# EAGLE design lna-plug (EAGLE 7.1.0)

## Sheet 1 of 3
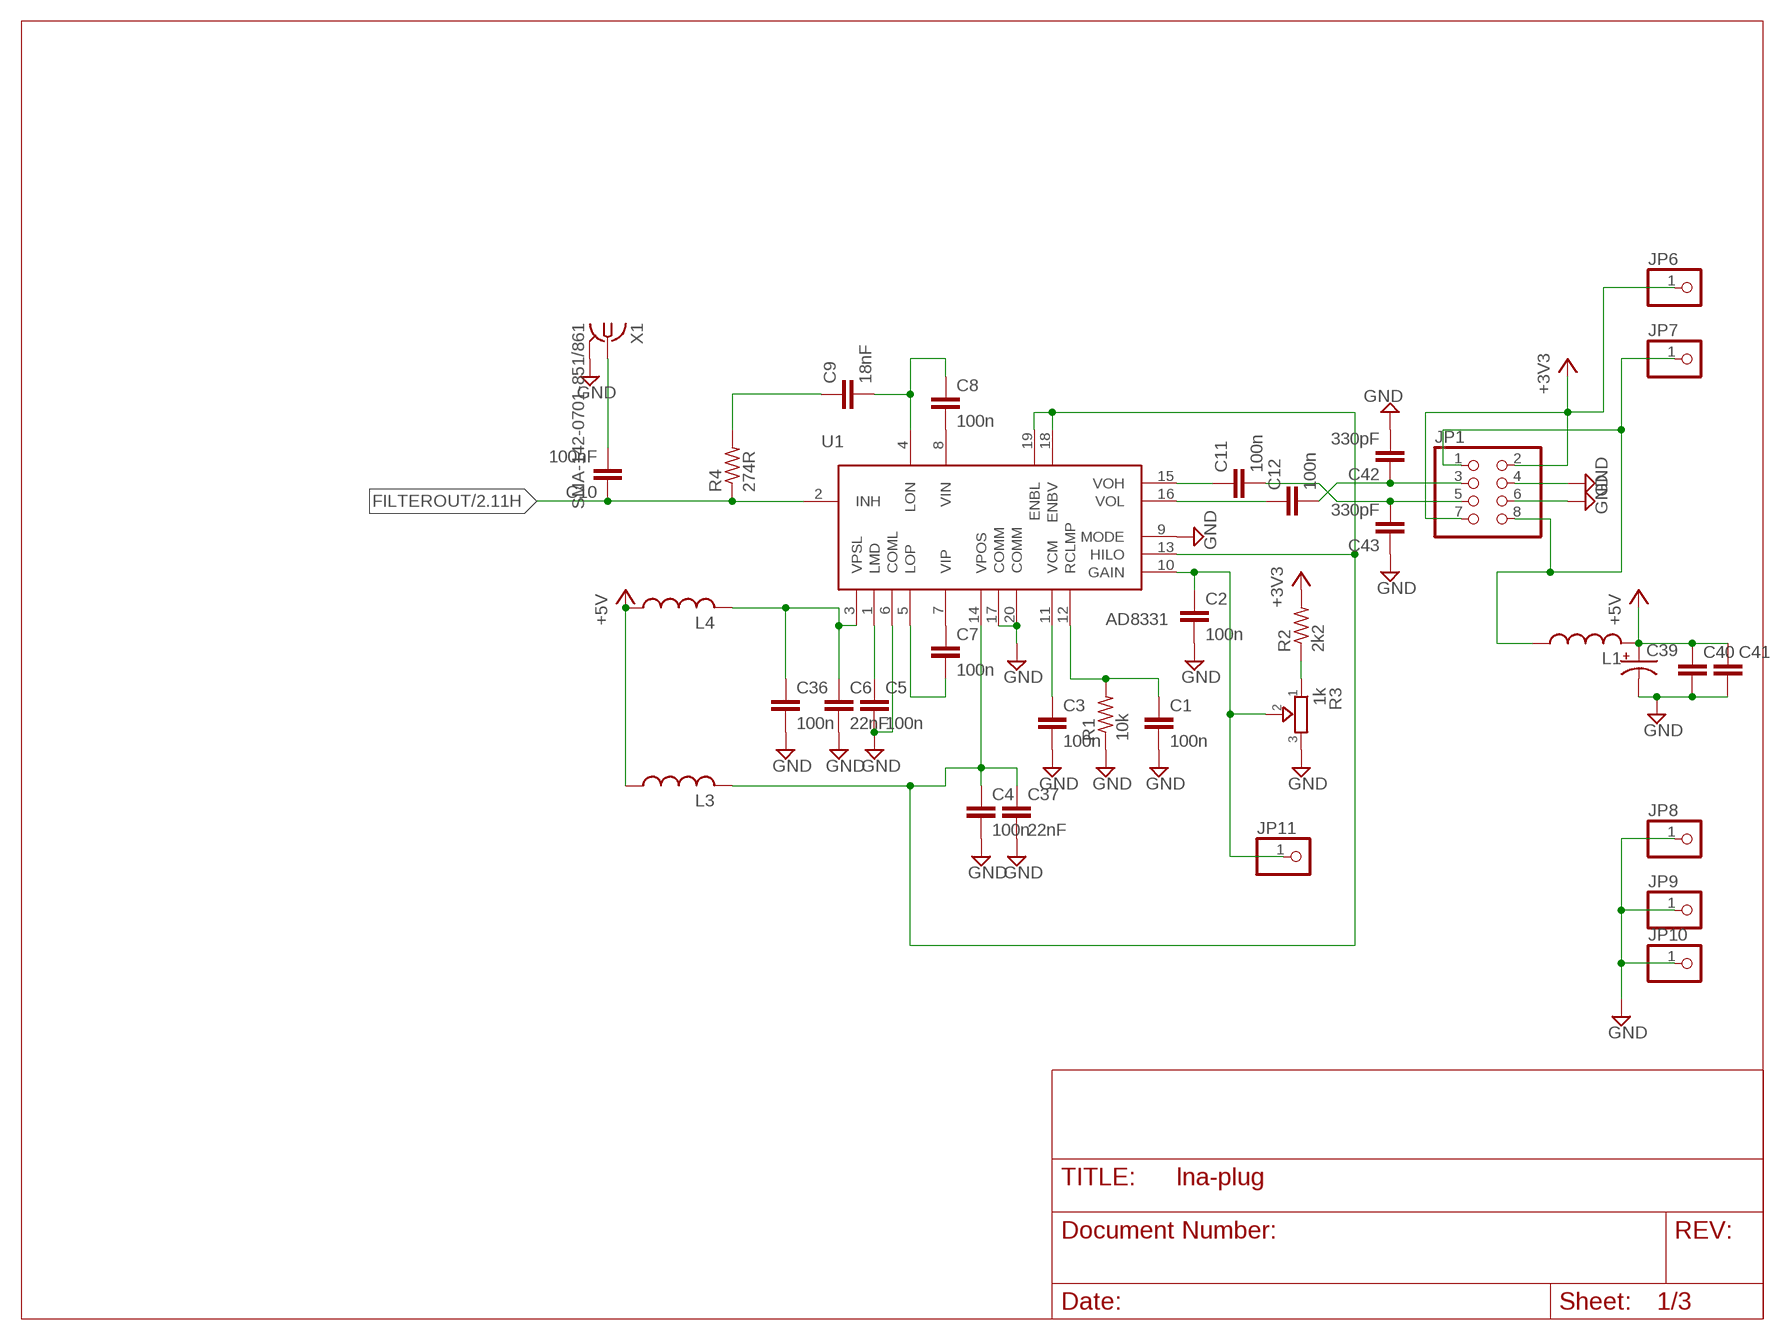
[diagram p0: schematic, sheet 1]

### Parts
C1  100n  C-EUC0603  [C0603]
C2  100n  C-EUC0603  [C0603]
C3  100n  C-EUC0603  [C0603]
C4  100n  C-EUC0603  [C0603]
C5  100n  C-EUC0603  [C0603]
C6  22nF  C-EUC0603  [C0603]
C7  100n  C-EUC0603  [C0603]
C8  100n  C-EUC0603  [C0603]
C9  18nF  C-EUC0603  [C0603]
C10  100nF  C-EUC0603  [C0603]
C11  100n  C-EUC0603  [C0603]
C12  100n  C-EUC0603  [C0603]
C36  100n  C-EUC0603  [C0603]
C37  22nF  C-EUC0603  [C0603]
C39  CPOL-USSMCC  [SMC_C]
C40  C-EUC1206  [C1206]
C41  C-EUC0805  [C0805]
C42  330pF  C-EUC0603  [C0603]
C43  330pF  C-EUC0603  [C0603]
JP1  PINHD-2X4  [2X04]
JP6  PINHD-1X1  [1X01]
JP7  PINHD-1X1  [1X01]
JP8  PINHD-1X1  [1X01]
JP9  PINHD-1X1  [1X01]
JP10  PINHD-1X1  [1X01]
JP11  PINHD-1X1  [1X01]
L1  L-USL2012C  [L2012C]
L3  L-USL2012C  [L2012C]
L4  L-USL2012C  [L2012C]
R1  10k  R-US_R0603  [R0603]
R2  2k2  R-US_R0603  [R0603]
R3  1k  TRIMMER-3362P  [TRIMMER_3362P]
R4  274R  R-US_R0603  [R0603]
U1  AD8331  [QSOP20]
X1  SMA-142-0701-851/861  [J502-ND-142-0701-851/861]

### Nets
+3V3: JP1.2 JP1.7 JP6.1 R2.2 ; also sheet 3
+5V: C39.+ C40.1 C41.1 L1.2 L3.1 L4.1
FILTEROUT: C10.1 R4.1 U1.2(INH) ; also sheet 2
GND: C1.2 C2.2 C3.2 C4.2 C5.2 C6.2 C36.2 C37.2 C39.- C40.2 C41.2 C42.2 C43.1 JP1.4 JP1.6 JP8.1 JP9.1 JP10.1 R1.1 R3.3 U1.6(COML) U1.9(MODE) U1.17(COMM) U1.20(COMM) X1.G@1 X1.G@2 X1.G@3 X1.G@4 ; also sheet 2,3
N$1: C7.1 U1.7(VIP)
N$2: C8.2 U1.8(VIN)
N$3: C8.1 C9.2 U1.4(LON)
N$5: C7.2 U1.5(LOP)
N$7: C3.1 U1.11(VCM)
N$8: C1.1 R1.2 U1.12(RCLMP)
N$10: C2.1 JP11.1 R3.2 U1.10(GAIN)
N$11: R2.1 R3.1
N$15: C5.1 U1.1(LMD)
N$16: C6.1 C36.1 L4.2 U1.3(VPSL)
N$19: C9.1 R4.2
N$21: C12.1 U1.16(VOL)
N$22: C11.1 U1.15(VOH)
N$23: C12.2 C42.1 JP1.3
N$24: C11.2 C43.2 JP1.5
N$25: JP1.1 JP1.8 JP7.1 L1.1
N$35: C10.2 X1.1
N$45: C4.1 C37.1 L3.2 U1.13(HILO) U1.14(VPOS) U1.18(ENBV) U1.19(ENBL)

## Sheet 2 of 3
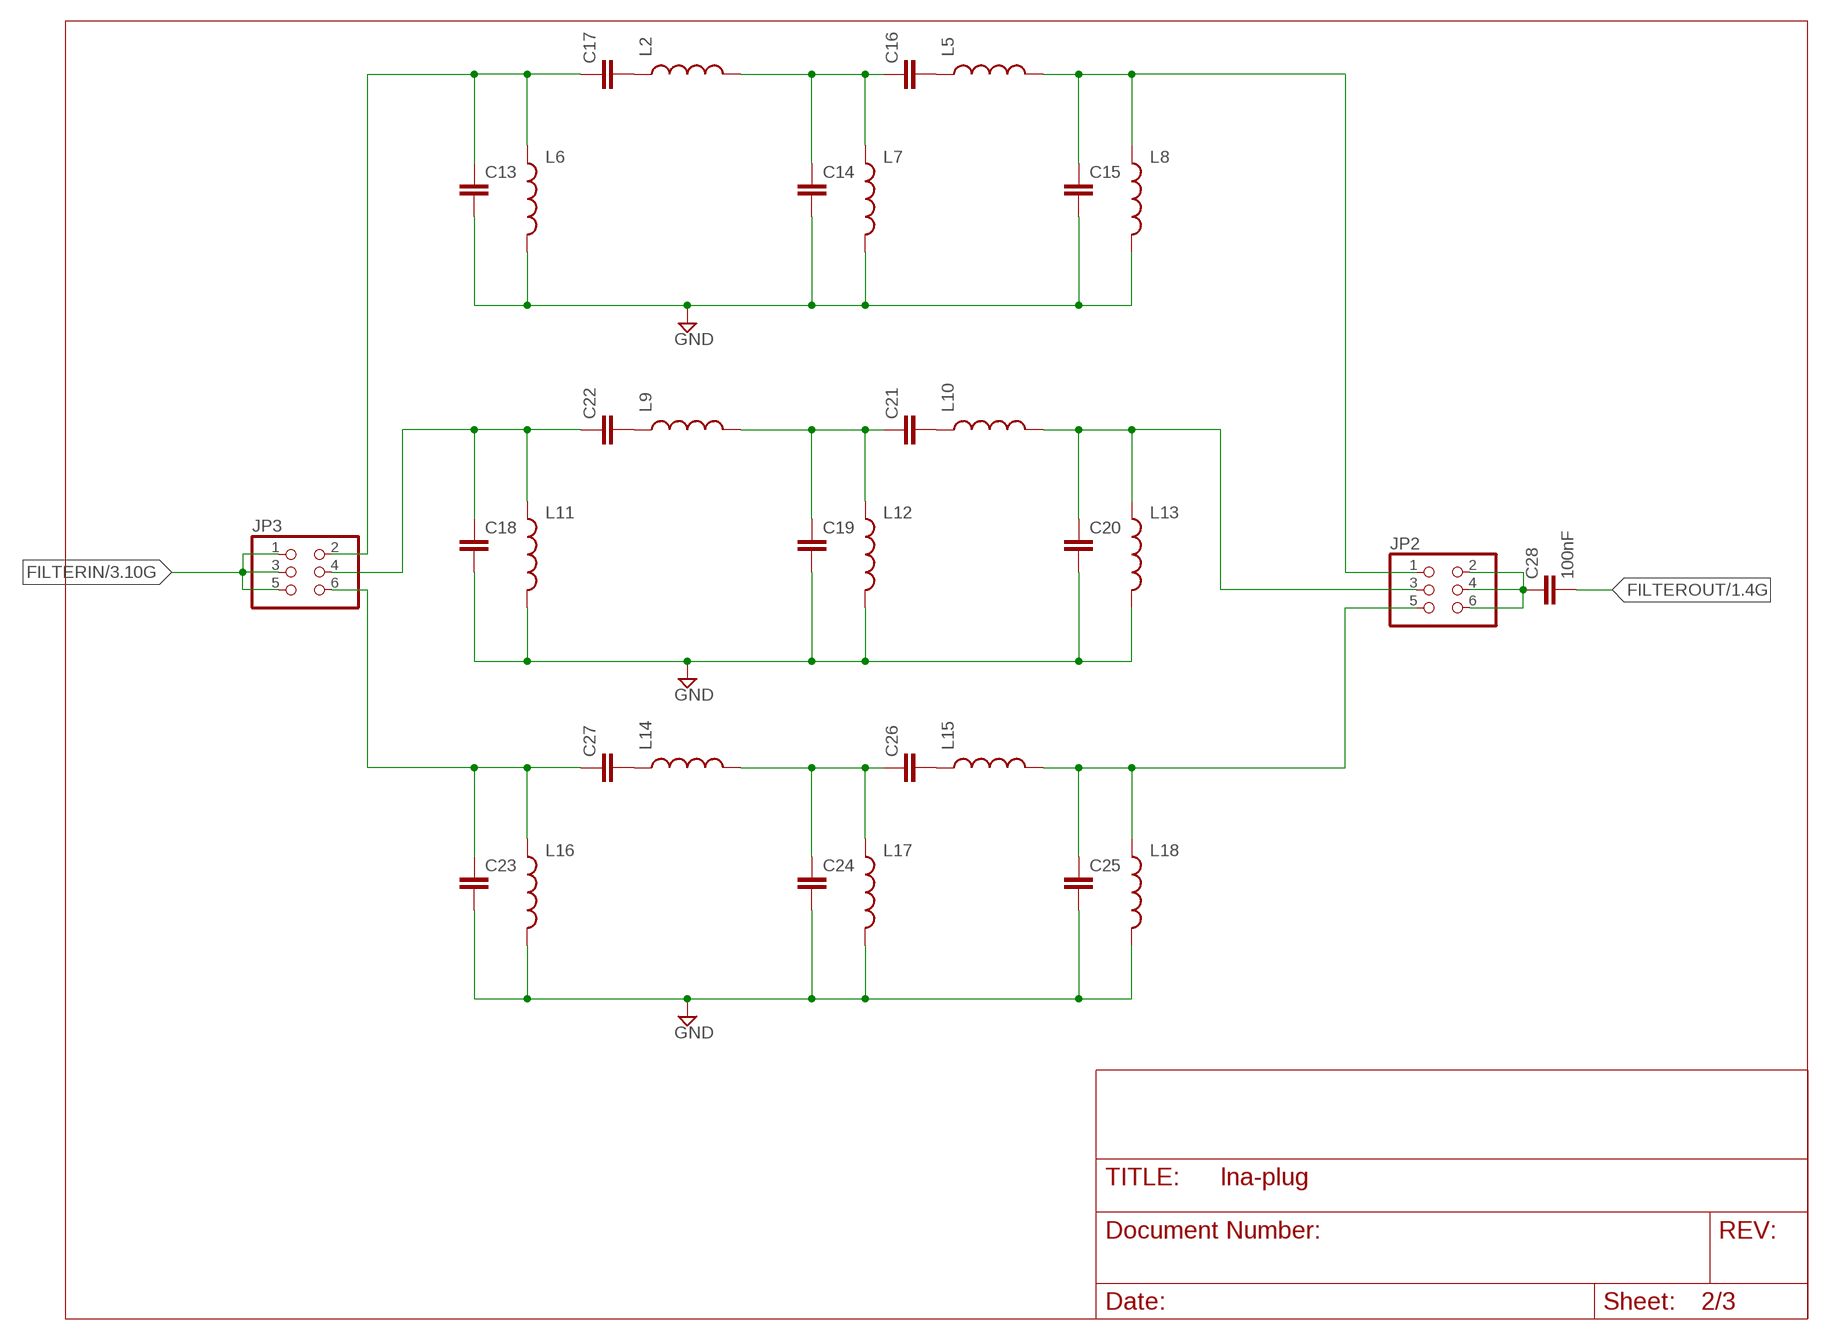
[diagram p1: schematic, sheet 2]

### Parts
C13  C-EUC0603  [C0603]
C14  C-EUC0603  [C0603]
C15  C-EUC0603  [C0603]
C16  C-EUC0603  [C0603]
C17  C-EUC0603  [C0603]
C18  C-EUC0603  [C0603]
C19  C-EUC0603  [C0603]
C20  C-EUC0603  [C0603]
C21  C-EUC0603  [C0603]
C22  C-EUC0603  [C0603]
C23  C-EUC0603  [C0603]
C24  C-EUC0603  [C0603]
C25  C-EUC0603  [C0603]
C26  C-EUC0603  [C0603]
C27  C-EUC0603  [C0603]
C28  100nF  C-EUC0603  [C0603]
JP2  PINHD-2X3  [2X03]
JP3  PINHD-2X3  [2X03]
L2  INDUCTOR0603  [0603]
L5  INDUCTOR0603  [0603]
L6  INDUCTOR0603  [0603]
L7  INDUCTOR0603  [0603]
L8  INDUCTOR0603  [0603]
L9  INDUCTOR0603  [0603]
L10  INDUCTOR0603  [0603]
L11  INDUCTOR0603  [0603]
L12  INDUCTOR0603  [0603]
L13  INDUCTOR0603  [0603]
L14  INDUCTOR0603  [0603]
L15  INDUCTOR0603  [0603]
L16  INDUCTOR0603  [0603]
L17  INDUCTOR0603  [0603]
L18  INDUCTOR0603  [0603]

### Nets
FILTERIN: JP3.1 JP3.3 JP3.5 ; also sheet 3
FILTEROUT: C28.2 ; also sheet 1
GND: C13.2 C14.2 C15.2 C18.2 C19.2 C20.2 C23.2 C24.2 C25.2 L6.2 L7.2 L8.2 L11.2 L12.2 L13.2 L16.2 L17.2 L18.2 ; also sheet 1,3
N$9: C17.2 L2.1
N$12: C16.2 L5.1
N$13: C14.1 C16.1 L2.2 L7.1
N$14: C15.1 JP2.1 L5.2 L8.1
N$17: C23.1 C27.1 JP3.6 L16.1
N$20: C22.2 L9.1
N$26: C21.2 L10.1
N$27: C19.1 C21.1 L9.2 L12.1
N$28: C25.1 JP2.5 L15.2 L18.1
N$29: C18.1 C22.1 JP3.4 L11.1
N$30: C27.2 L14.1
N$31: C26.2 L15.1
N$32: C24.1 C26.1 L14.2 L17.1
N$33: C28.1 JP2.2 JP2.4 JP2.6
N$34: C13.1 C17.1 JP3.2 L6.1
N$37: C20.1 JP2.3 L10.2 L13.1

## Sheet 3 of 3
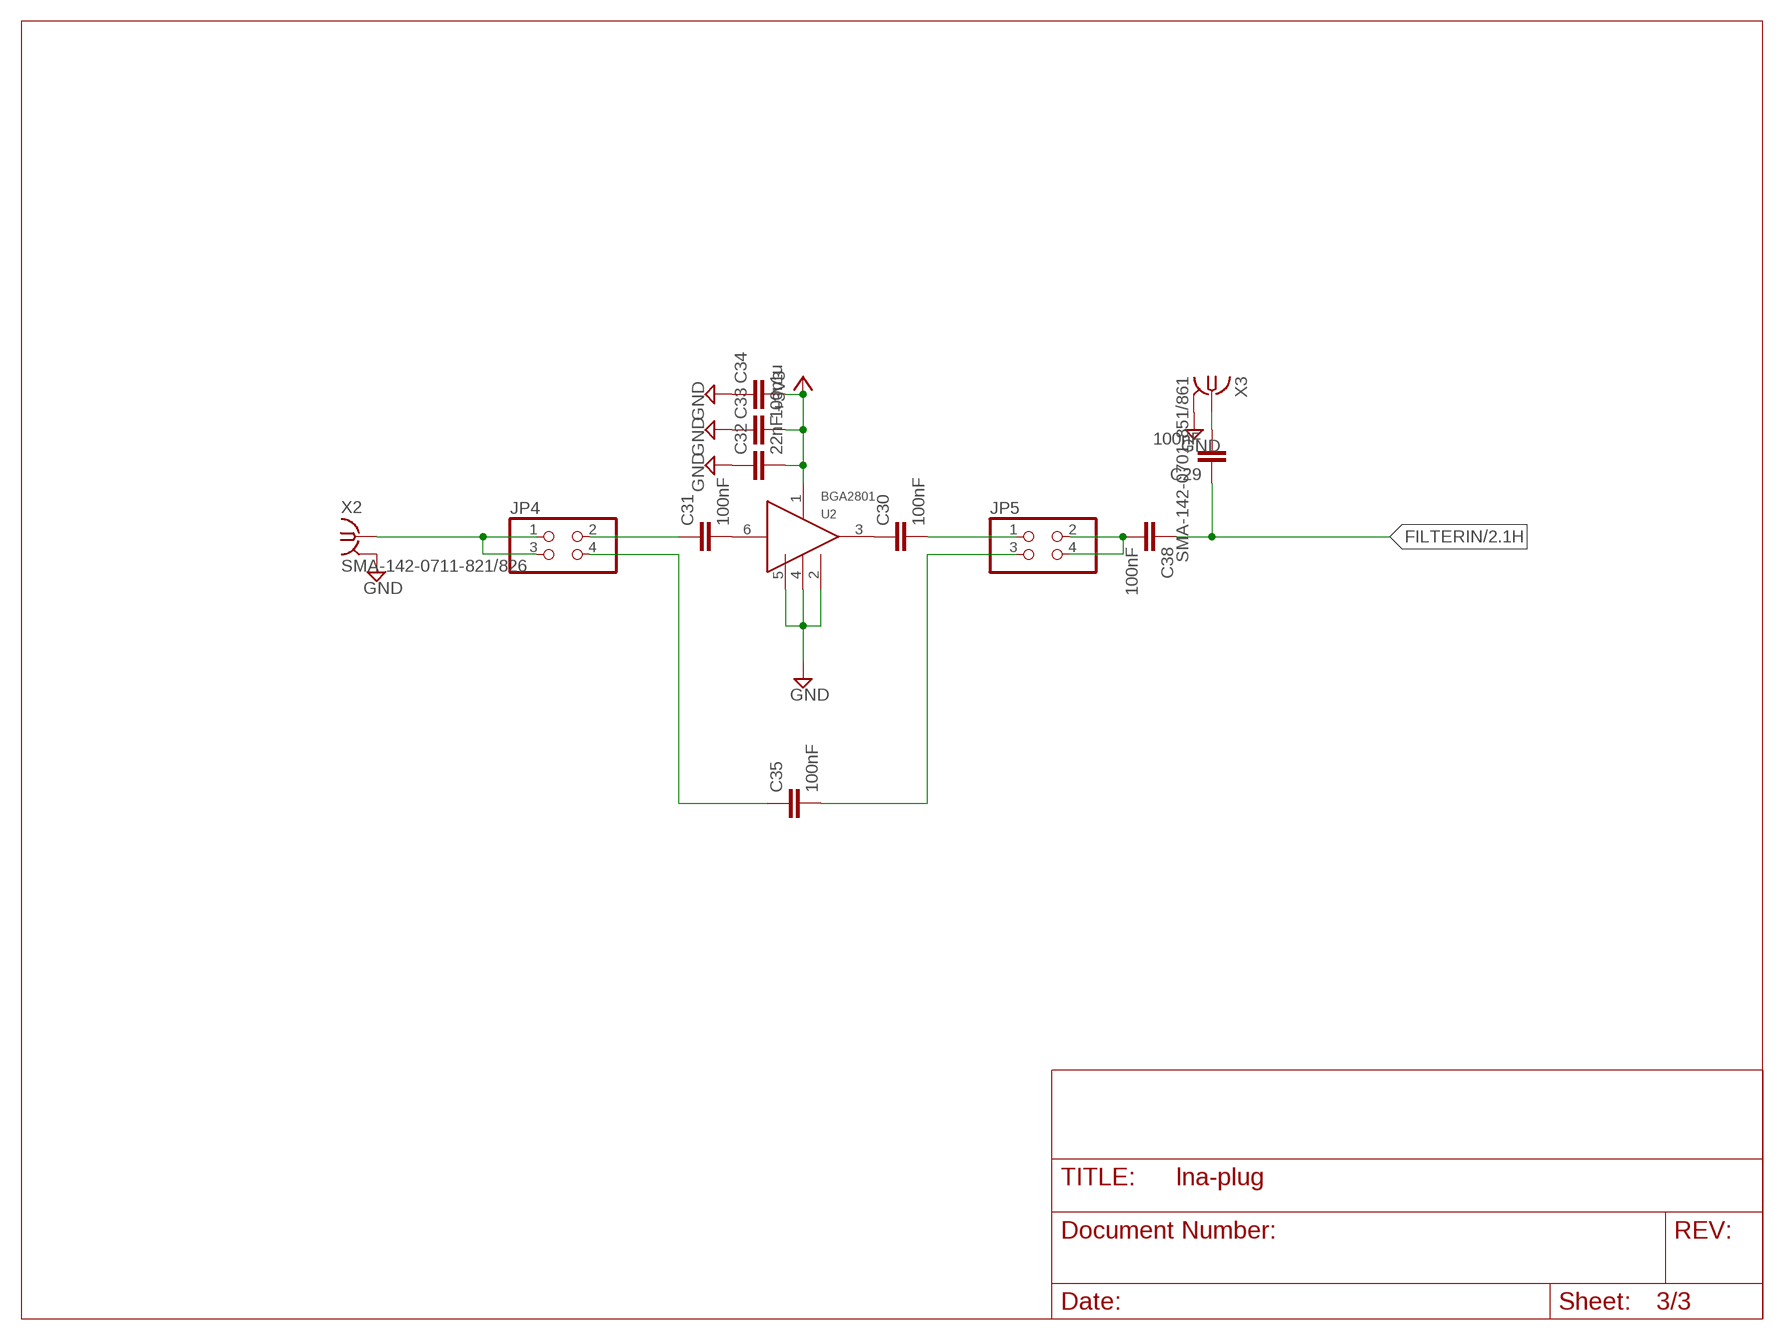
[diagram p2: schematic, sheet 3]

### Parts
C29  100nF  C-EUC0603  [C0603]
C30  100nF  C-EUC0603  [C0603]
C31  100nF  C-EUC0603  [C0603]
C32  22nF  C-EUC0603  [C0603]
C33  100n  C-EUC0603  [C0603]
C34  1u  C-EUC0603  [C0603]
C35  100nF  C-EUC0603  [C0603]
C38  100nF  C-EUC0603  [C0603]
JP4  PINHD-2X2  [2X02]
JP5  PINHD-2X2  [2X02]
U2  BGA2801  [SOTT323-6]
X2  SMA-142-0711-821/826  [J502-ND-142-0711-821/826]
X3  SMA-142-0701-851/861  [J502-ND-142-0701-851/861]

### Nets
+3V3: C32.2 C33.2 C34.2 U2.1(VCC) ; also sheet 1
FILTERIN: C29.1 C38.1 ; also sheet 2
GND: C32.1 C33.1 C34.1 U2.2(GND) U2.4(GND) U2.5(GND) X2.G@1 X2.G@2 X2.G@3 X2.G@4 X3.G@1 X3.G@2 X3.G@3 X3.G@4 ; also sheet 1,2
N$4: C38.2 JP5.2 JP5.4
N$18: C29.2 X3.1
N$36: C30.1 U2.3(OUT)
N$38: C31.2 U2.6(IN)
N$39: JP4.1 JP4.3 X2.1
N$40: C31.1 JP4.2
N$41: C30.2 JP5.1
N$42: C35.1 JP4.4
N$43: C35.2 JP5.3

## Library data of the parts
C1-C38 C42 C43 = resistor:C-EU: CAPACITOR, European symbol
C39 = rcl:CPOL-US: POLARIZED CAPACITOR, American symbol
C40 C41 = rcl:C-EU: CAPACITOR, European symbol
JP1 = pinhead:PINHD-2X4: PIN HEADER
JP2 JP3 = pinhead:PINHD-2X3: PIN HEADER
JP4 JP5 = pinhead:PINHD-2X2: PIN HEADER
JP6-JP11 = pinhead:PINHD-1X1: PIN HEADER
L1 L3 L4 = rcl:L-US: INDUCTOR, American symbol
L2 L5-L18 = SparkFun:INDUCTOR: Inductors Basic Inductor/Choke - 0603 and 1206. Footprints are not proven and vary greatly between part numbers.
R1 R2 R4 = resistor:R-US_: RESISTOR, American symbol
R3 = dp_devices:TRIMMER: Trimmer resistor
U1 = customs:AD8331
U2 = customs:BGA2801
X1 X3 = con-coax:SMA-: SMA 50 Ohm End Launch Jack Receptacle - Round Contact Johnson Components Source: www.johnsoncomponents.com .. J502-ND.pdf; MF: JOHNSON COMPONENTS; MPN: 142-0701-851; OC_FARNELL: 1019325; OC_NEWARK: 99F6798
X2 = con-coax:SMA-: SMA 50 Ohm End Launch Jack Receptacle - Round Contact Johnson Components Source: www.johnsoncomponents.com .. J502-ND.pdf; MF: JOHNSON COMPONENTS; MPN: 142-0711-821; OC_FARNELL: 1019328; OC_NEWARK: 16F3627

## Board
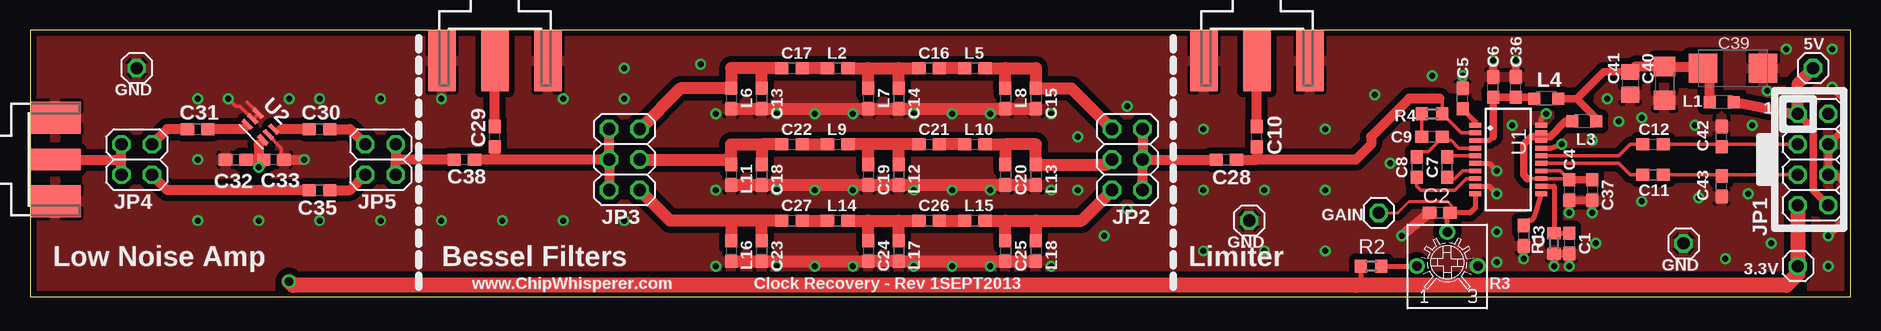
[diagram p3: board, top side]
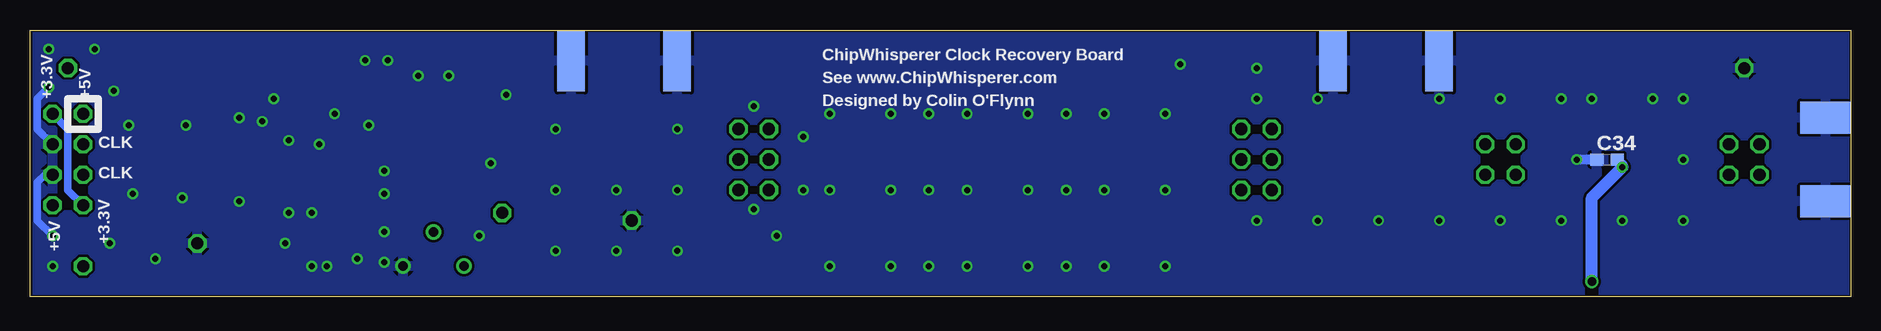
[diagram p4: board, bottom side, seen from below]

Size 151.75 x 22.23 mm. Coordinates in mm from the lower left corner, seen from the top.
Outline: 0,0 151.75,0 151.75,22.21 0,22.21 0,0
Copper layers (1*16): Top 0.035mm / dielectric 1.5mm / Bottom 0.035mm
Design rules "default *": minimum track width 10mil, minimum drill 18mil, track to track 8mil, track to pad 8mil, pad to pad 8mil, via to via 8mil, smd to smd 0mil, copper to edge 5mil, drill to drill 8mil, minimum pad ring 10mil, minimum via ring 8mil, stop-mask expansion 4mil, vias tented up to drill 20mil, thermal gap 10mil

### Footprints (pad centres in the part's own frame; a part is rotated, then mirrored left to right if it is on the bottom)
C0603 = smd 1.1 x 1: 1 -0.85,0; 2 0.85,0
SMC_C = smd 2.4 x 2.4: + -2.5,0; - 2.5,0
C1206 = smd 1.6 x 1.8: 1 -1.4,0; 2 1.4,0
C0805 = smd 1.3 x 1.5: 1 -0.95,0; 2 0.95,0
2X04 = drill 1.016 octagon: 1 -3.81,-1.27; 2 -3.81,1.27; 3 -1.27,-1.27; 4 -1.27,1.27; 5 1.27,-1.27; 6 1.27,1.27; 7 3.81,-1.27; 8 3.81,1.27
2X03 = drill 1.016 octagon: 1 -2.54,-1.27; 2 -2.54,1.27; 3 0,-1.27; 4 0,1.27; 5 2.54,-1.27; 6 2.54,1.27
2X02 = drill 1.016 octagon: 1 -1.27,-1.27; 2 -1.27,1.27; 3 1.27,-1.27; 4 1.27,1.27
1X01 = drill 1.016 octagon: 1 0,0
L2012C = smd 1 x 1: 1 -1,0; 2 1,0
0603 = smd 1.1 x 1: 1 -0.85,0; 2 0.85,0
R0603 = smd 1 x 1.1: 1 -0.85,0; 2 0.85,0
TRIMMER_3362P = drill 0.8: 1 -2.54,-0.31; 2 0,2.54; 3 2.54,-0.31
QSOP20 = smd 0.4 x 1: 1 -2.858,-2.75; 2 -2.223,-2.75; 3 -1.588,-2.75; 4 -0.953,-2.75; 5 -0.318,-2.75; 6 0.318,-2.75; 7 0.953,-2.75; 8 1.588,-2.75; 9 2.223,-2.75; 10 2.858,-2.75; 11 2.858,2.75; 12 2.223,2.75; 13 1.588,2.75; 14 0.953,2.75; 15 0.318,2.75; 16 -0.318,2.75; 17 -0.953,2.75; 18 -1.588,2.75; 19 -2.223,2.75; 20 -2.858,2.75
SOTT323-6 = smd 0.4 x 1.05: 1 -1.3,0; 2 -0.65,0; 3 0,0; 4 0,1.85; 5 -0.65,1.85; 6 -1.3,1.85
J502-ND-142-0701-851/861 = smd 5.08 x 2.286: 1 2.565,0; G@1 2.565,4.42; G@2 2.565,-4.42 | smd 5.08 x 2.286 bottom: G@3 2.565,4.42; G@4 2.565,-4.42
J502-ND-142-0711-821/826 = smd 4.191 x 1.778: 1 2.115,0 | smd 4.191 x 2.667: G@1 2.115,3.495; G@2 2.115,-3.495 | smd 4.191 x 2.667 bottom: G@3 2.115,3.495; G@4 2.115,-3.495

### Placement (x,y rotation side)
C1  128.27,4.45 270 top
C2  117.47,6.98 180 top
C3  124.46,5.08 270 top
C4  128.27,8.89 270 top
C5  119.38,16.51 90 top
C6  121.92,17.46 90 top
C7  118.11,10.8 90 top
C8  115.57,10.8 270 top
C9  116.84,13.34 0 top
C10  102.23,13.34 90 top
C11  135.25,10.16 0 top
C12  135.25,12.7 0 top
C13  60.96,16.51 270 top
C14  72.39,16.51 270 top
C15  83.82,16.51 270 top
C16  74.93,19.05 0 top
C17  63.5,19.05 0 top
C18  60.96,10.16 270 top
C19  69.85,10.16 270 top
C20  81.28,10.16 270 top
C21  74.93,12.7 0 top
C22  63.5,12.7 0 top
C23  60.96,3.81 270 top
C24  69.85,3.81 270 top
C25  81.28,3.81 270 top
C26  74.93,6.35 0 top
C27  63.5,6.35 0 top
C28  99.69,11.43 0 top
C29  38.73,13.34 90 top
C30  24.13,13.97 0 top
C31  13.97,13.97 0 top
C32  17.14,11.43 0 top
C33  20.32,11.43 180 top
C34  20.32,11.43 0 bottom
C35  24.13,8.89 0 top
C36  123.83,17.46 90 top
C37  130.18,8.89 270 top
C38  36.2,11.43 180 top
C39  141.92,19.05 0 top
C40  136.21,17.78 270 top
C41  133.35,17.78 270 top
C42  140.97,13.34 90 top
C43  140.97,9.21 90 top
JP1  148.59,11.43 270 top
JP2  91.44,11.43 270 top
JP3  49.53,11.43 270 top
JP4  8.89,11.43 270 top
JP5  29.21,11.43 270 top
JP6  147.32,2.54 0 top
JP7  148.59,19.05 0 top
JP8  137.8,4.45 0 top
JP9  101.6,6.35 0 top
JP10  8.89,19.05 0 top
JP11  112.39,6.98 0 top
L1  140.97,16.19 180 top
L2  67.31,19.05 0 top
L3  129.54,14.61 180 top
L4  126.36,16.51 180 top
L5  78.74,19.05 0 top
L6  58.42,16.51 270 top
L7  69.85,16.51 270 top
L8  81.28,16.51 270 top
L9  67.31,12.7 0 top
L10  78.74,12.7 0 top
L11  58.42,10.16 270 top
L12  72.39,10.16 270 top
L13  83.82,10.16 270 top
L14  67.31,6.35 0 top
L15  78.74,6.35 0 top
L16  58.42,3.81 270 top
L17  72.39,3.81 270 top
L18  83.82,3.81 270 top
R1  127,4.45 90 top
R2  111.76,2.54 180 top
R3  118.11,2.86 0 top
R4  116.84,15.24 180 top
U1  123.19,11.43 270 top
U2  20.32,13.97 45 top
X1  102.23,22.23 270 top
X2  0,11.43 0 top
X3  38.73,22.23 270 top

### Tracks (layer width: path | path; a pad name or v marks a point on that pad's centre or on a via)
+3V3  (via drill 0.5, 0.7)
  Top 0.406: U2.1 19.05,12.7 | R2.2 110.91,1.37 110.49,0.95
  Top 0.813: 19.05,12.7 19.05,11.43 C34.2 | C34.2 C32.2 | C34.2 19.47,11.22 v19.05,10.8
  Top 1.27: JP1.7 JP6.1 147.32,1.91 146.37,0.95 110.49,0.95 21.91,0.95 v21.59,1.27
  Bottom 0.61: JP1.7 148.59,8.89 148.59,13.97 JP1.2
  Bottom 0.813: v19.05,10.8 19.05,11.01 C34.2
  Bottom 1.016: v21.59,1.27 21.59,8.26 v19.05,10.8
+5V
  Top 0.61: C41.1 131.12,18.73 128.9,16.51 | 128.9,16.51 L4.1 | L3.1 130.54,14.88 128.9,16.51
  Top 0.813: L1.2 139.97,18.5 C39.+ 139.29,19.18 C40.1 133.8,19.18 C41.1
FILTERIN
  Top 0.813: JP3.3 JP3.1 | JP3.3 JP3.5 | JP3.3 38.73,11.43 | 38.73,11.43 C38.1 | C29.1 38.73,11.43
FILTEROUT
  Top 0.305: U1.2 119.28,13.65 R4.1 117.69,16.3 117.47,16.51
  Top 0.813: C28.2 102.23,11.43 | 117.47,16.51 114.94,16.51 111.76,13.34 111.76,12.7 110.49,11.43 102.23,11.43 | C10.1 102.23,11.43
GND  (via drill 0.5)
  Top 0.305: U2.2 19.86,13.48 20.95,12.38 20.95,11.65 C34.1 | v16.51,16.51 17.14,15.88 17.46,15.88 18.52,14.82 U2.5 18.63,14.82 19.05,15.24 | U2.4 | U2.4 18.1,16.19
  Top 0.406: U1.17 126.68,12.38 v127.64,12.7 | U1.20 125.94,14.82 v126.36,15.24 | U1.6 121.6,11.11 v122.24,10.48 | U1.9 121.6,9.21 v122.24,8.57
  Top 0.61: v128.27,6.98 C4.2 C37.2 v130.18,6.98 | C36.2 v123.83,19.69 | C6.2 v121.92,19.69 | C5.2 v119.38,18.41 | C3.2 v124.46,3.18 | v127,2.54 R1.1 C1.2 v128.27,2.54 | v149.86,5.08 151.13,6.35 151.13,9.52 150.5,10.16 JP1.6 JP1.4 151.13,13.97 151.13,16.51 v150.18,17.46
  Top 0.813: C2.2 v114.3,5.08 | C34.1 v22.86,11.43
  Top 1.016: L6.2 C13.2 L7.2 C14.2 L8.2 C15.2 | L11.2 C18.2 C19.2 L12.2 C20.2 L13.2 | L18.2 C25.2 L17.2 C24.2 C23.2 L16.2
  Bottom 0.61: JP1.4 151.13,13.97 151.13,16.51 v150.18,17.46 | JP1.6 150.5,10.16 151.13,9.52 151.13,6.35 v149.86,5.08
  Bottom 0.813: C34.1 v22.86,11.43
  other vias: 57.15,2.54 57.15,8.89 57.15,15.24 62.23,15.24 68.58,15.24 73.66,15.24 80.01,15.24 85.09,15.24 85.09,8.89 80.01,8.89 73.66,8.89 68.58,8.89 62.23,8.89 62.23,2.54 68.58,2.54 73.66,2.54 80.01,2.54 85.09,2.54 13.97,11.43 13.97,6.35 19.05,6.35 24.13,6.35 29.21,6.35 34.29,6.35 39.37,6.35 44.45,6.35 49.53,6.35 13.97,16.51 21.59,16.51 24.13,16.51 29.21,16.51 34.29,16.51 44.45,16.51 49.53,16.51 49.53,19.05 55.88,19.37 65.41,15.24 76.83,15.24 76.83,8.89 76.83,2.54 65.41,2.54 65.41,8.89 91.44,7.3 91.44,15.88 87.31,13.34 87.31,8.89 89.53,5.08 113.35,11.11 116.84,18.41 122.24,5.4 130.49,4.45 130.18,13.02 134.3,14.92 134.3,7.94 143.19,8.57 139.06,8.26 138.75,14.29 97.79,8.89 102.87,8.89 107.95,8.89 107.95,3.81 102.87,3.81 97.79,3.81 107.95,13.97 97.79,13.97 131.44,16.51 132.4,14.61 123.51,14.29 149.86,2.54 150.18,20.64 146.37,20.64 144.78,17.15 145.1,4.45 141.29,3.18 122.24,2.86 112.08,16.83 143.51,14.29
  pour Top (isolate 0.508): 0,22.23 150.5,22.23 151.13,22.86 151.13,0 0,0 -0.63,-0.63 -0.63,21.59
  pour Bottom: 0,22.23 151.13,22.23 151.13,-0.63 -0.63,-0.63 -1.27,0 -1.27,20.32
N$1
  Top 0.305: U1.7 119.38,10.48 118.75,9.84 118.21,9.84 C7.1
N$2
  Top 0.305: U1.8 119.7,9.84 118.75,8.89 115.89,8.89 115.57,9.21 C8.2
N$3
  Top 0.305: U1.4 119.06,12.38 118.43,13.02 118.01,13.02 C9.2 117.69,13.23 116.52,12.07 115.99,12.07 C8.1
N$4
  Top 0.813: C38.2 30.48,11.43 | JP5.2 30.48,11.43 | JP5.4 30.48,11.43
N$5
  Top 0.305: U1.5 118.21,11.75 C7.2
N$7
  Top 0.406: U1.11 125.3,6.56 125.1,6.35 124.88,6.35 C3.1
N$8
  Top 0.406: U1.12 127,9.21 R1.2 C1.1
N$9
  Top 1.016: L2.1 C17.2
N$10
  Top 0.254: JP11.1 113.98,6.98 114.94,7.94 118.11,7.94 118.43,7.62 118.43,7.09 C2.1
  Top 0.406: R3.2 118.11,6.77 C2.1 120.02,6.98 120.44,7.41 U1.10
N$11
  Top 0.406: R2.1 115.26,2.54 R3.1
N$12
  Top 1.016: L5.1 C16.2
N$13
  Top 1.016: L2.2 69.85,19.05 | 69.85,19.05 72.39,19.05 | 72.39,19.05 C16.1 | C14.1 72.39,19.05 | L7.1 69.85,19.05
N$14
  Top 1.016: L5.2 81.28,19.05 | 81.28,19.05 83.82,19.05 C15.1 86.78,17.36 JP2.1 | L8.1 81.28,19.05
N$15
  Top 0.406: U1.1 120.44,14.6 C5.1
N$16
  Top 0.406: U1.3 121.6,13.02 121.92,13.34
  Top 0.61: 121.92,13.34 C6.1 C36.1 125.26,16.61 L4.2
N$17
  Top 1.016: C27.1 60.96,6.35 | 60.96,6.35 58.42,6.35 | 58.42,6.35 L16.1 | C23.1 60.96,6.35 | 58.42,6.35 53.34,6.35 JP3.6
N$18
  Top 0.813: C29.2 X3.1
N$19
  Top 0.305: R4.2 C9.1
N$20
  Top 1.016: C22.2 L9.1
N$21
  Top 0.305: U1.16 132.4,11.75 133.35,12.7 C12.1
N$22
  Top 0.305: U1.15 132.4,11.11 133.35,10.16 C11.1
N$23
  Top 0.305: C12.2 140.97,12.7 | 140.97,12.7 JP1.3 | C42.1 140.97,12.7
N$24
  Top 0.305: C11.2 140.97,10.16 | 140.97,10.16 JP1.5 | C43.2 140.97,10.16
N$25
  Top 0.61: JP1.8 148.59,8.89 148.59,13.97 JP1.1
  Top 0.813: JP1.1 146.73,15.24 L1.1
  Top 1.016: JP1.1 147.32,17.78 JP7.1
N$26
  Top 1.016: L10.1 C21.2
N$27
  Top 1.016: C21.1 72.39,12.7 | 72.39,12.7 69.85,12.7 | 69.85,12.7 L9.2 | C19.1 69.85,12.7 | L12.1 72.39,12.7
N$28
  Top 1.016: L15.2 81.28,6.35 | 81.28,6.35 83.82,6.35 | 83.82,6.35 L18.1 | C25.1 81.28,6.35 | 83.82,6.35 87.63,6.35 JP2.5
N$29
  Top 1.016: C22.1 60.96,12.7 | 60.96,12.7 C18.1 | 60.96,12.7 58.42,12.7 L11.1 58,11.43 JP3.4
N$30
  Top 1.016: C27.2 L14.1
N$31
  Top 1.016: C26.2 L15.1
N$32
  Top 1.016: L14.2 69.85,6.35 | 69.85,6.35 72.39,6.35 | 72.39,6.35 C26.1 | C24.1 69.85,6.35 | L17.1 72.39,6.35
N$33
  Top 0.813: JP2.4 C28.1 | JP2.2 JP2.4 | JP2.6 JP2.4
N$34
  Top 1.016: C17.1 60.96,19.05 | 60.96,19.05 58.42,19.05 L6.1 54.19,17.36 JP3.2 | C13.1 60.96,19.05
N$35
  Top 0.813: C10.2 X1.1
N$36
  Top 0.305: U2.3 C30.1
  Top 0.813: C30.1 20.95,13.97
N$37
  Top 1.016: L10.2 81.28,12.7 | 81.28,12.7 C20.1 | 81.28,12.7 83.82,12.7 L13.1 89.75,11.01 JP2.3
N$38
  Top 0.406: U2.6 18.09,14.28 17.78,13.97
  Top 0.813: 17.78,13.97 C31.2
N$39
  Top 0.813: X2.1 7.62,11.43 | 7.62,11.43 JP4.1 | JP4.3 7.62,11.43
N$40
  Top 0.813: C31.1 11.43,13.97 JP4.2
N$41
  Top 0.813: C30.2 26.67,13.97 JP5.1
N$42
  Top 0.813: C35.1 11.43,8.89 JP4.4
N$43
  Top 0.813: C35.2 26.67,8.89 JP5.3
N$45
  Top 0.305: U1.19 U1.18 126.26,13.34 126.68,13.34 | U1.14 127.53,10.48 C4.1 128.17,9.84 U1.13 124.78,9.84
  Top 0.61: C4.1 C37.1 | L3.2 127.95,14.61 126.68,13.34 125.1,13.34 124.46,12.7 124.46,10.16 124.78,9.84

### Text on the board
tPlace: 5V | GND | 1 | GAIN | GND | GND | 3.3V | Low Noise Amp | Bessel Filters | Limiter | www.ChipWhisperer.com | Clock Recovery - Rev 1SEPT2013
bPlace: ChipWhisperer Clock Recovery Board | See www.ChipWhisperer.com | Designed by Colin O'Flynn | +5V | +3.3V | CLK | CLK | +3.3V | +5V